# EAGLE design mainboard (EAGLE 6.3)
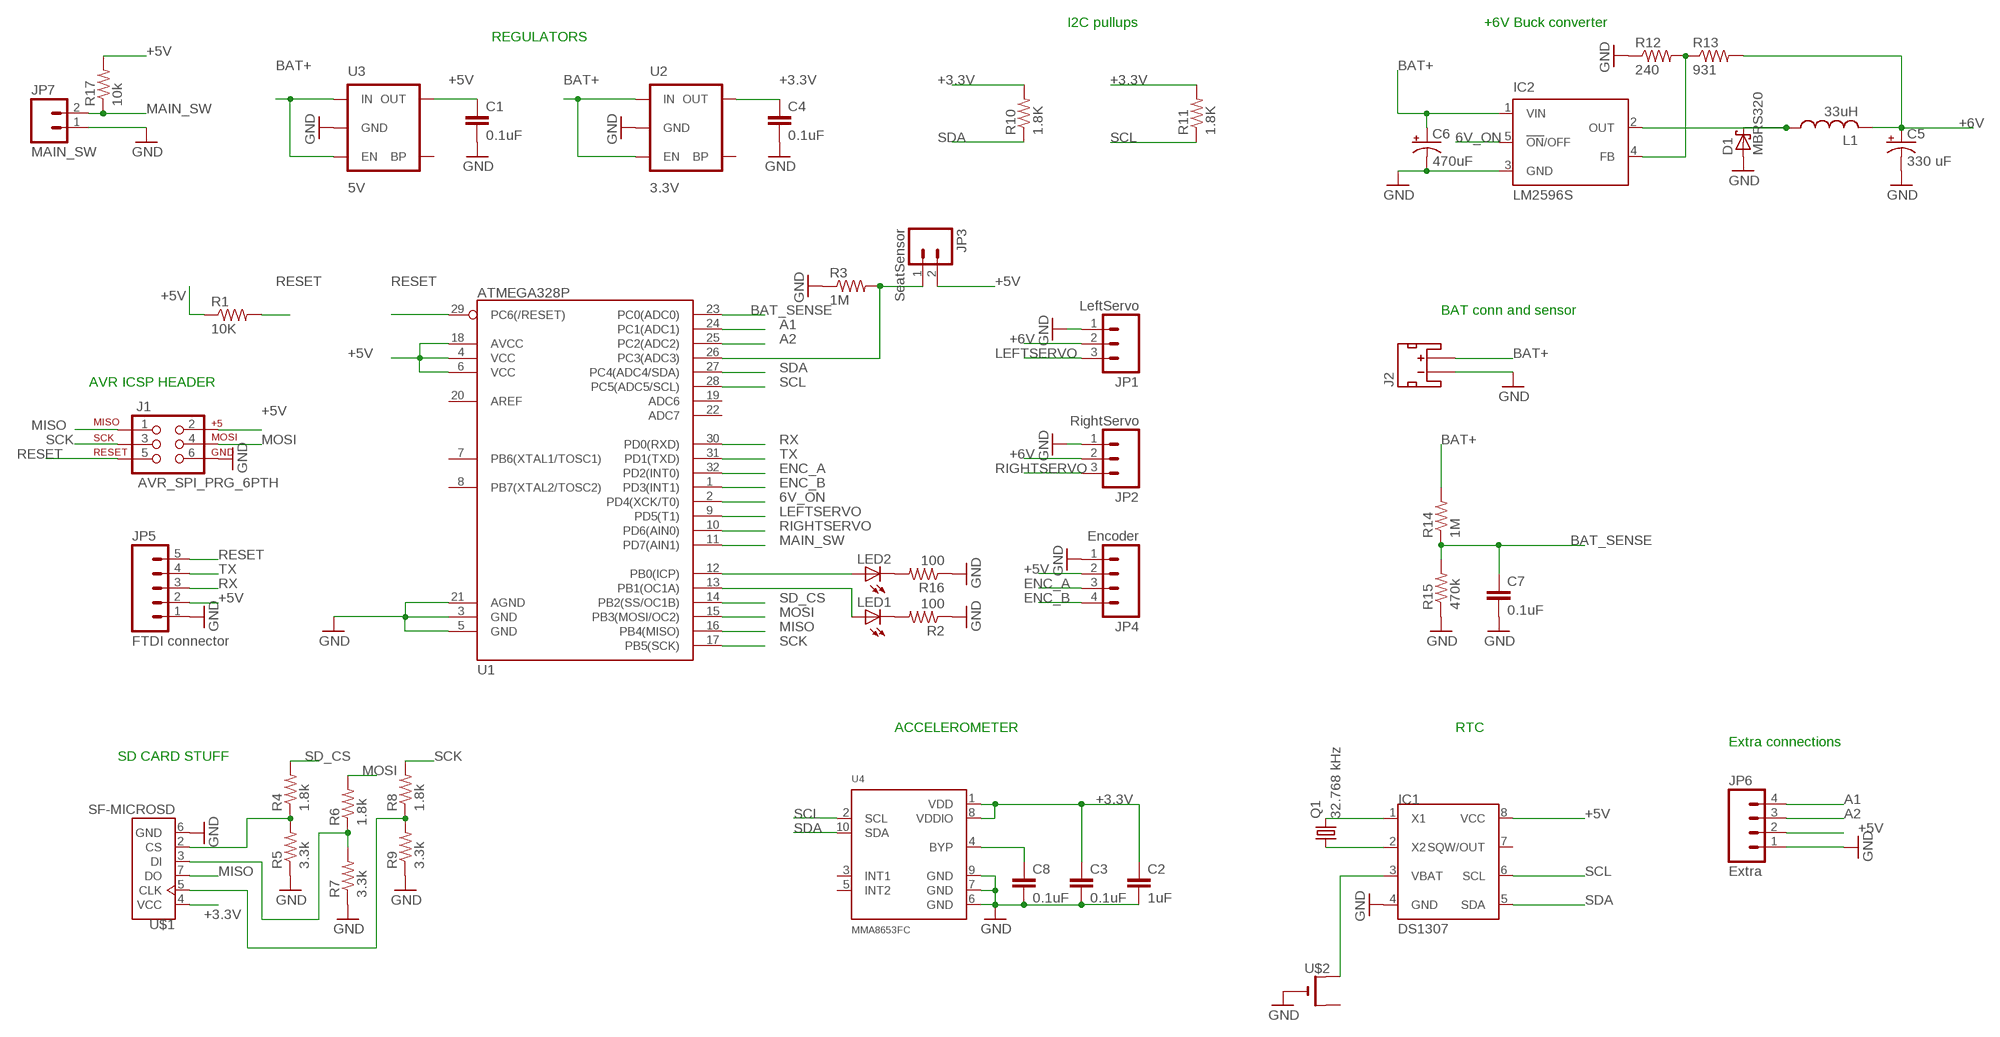
[diagram p0: schematic, sheet 1]

## Parts
C1  0.1uF  CAP0603-CAP  [0603-CAP]
C2  1uF  CAP0603-CAP  [0603-CAP]
C3  0.1uF  CAP0603-CAP  [0603-CAP]
C4  0.1uF  CAP0603-CAP  [0603-CAP]
C5  330 uF  CAP_POLE  [PANASONIC_E]
C6  470uF  CAP_POLG  [PANASONIC_G]
C7  0.1uF  CAP0603-CAP  [0603-CAP]
C8  0.1uF  CAP0603-CAP  [0603-CAP]
D1  MBRS320  SCHOTTKY-DIODESMC  [SMC]
IC1  DS1307  [SOIC-8]
IC2  LM2596S  [TO263-5]
J1  AVR_SPI_PRG_6PTH  [2X3]
J2  JST_2MM_MALE  [JST-2-SMD]
JP1  LeftServo  M03PTH  [1X03]
JP2  RightServo  M03PTH  [1X03]
JP3  SeatSensor  M02PTH  [1X02]
JP4  Encoder  M04PTH  [1X04]
JP5  FTDI connector  M05PTH  [1X05]
JP6  Extra  M04PTH  [1X04]
JP7  MAIN_SW  M02PTH  [1X02]
L1  33uH  L-SRR1280  [SRR1280]
LED1  LED1206  [LED-1206]
LED2  LED1206  [LED-1206]
Q1  32.768 kHz  CRYSTALTC38H  [TC38H]
R1  10K  RESISTOR0603-RES  [0603-RES]
R2  100  RESISTOR0603-RES  [0603-RES]
R3  1M  RESISTOR0603-RES  [0603-RES]
R4  1.8k  RESISTOR0603  [0603-RES]
R5  3.3k  RESISTOR0603  [0603-RES]
R6  1.8k  RESISTOR0603  [0603-RES]
R7  3.3k  RESISTOR0603  [0603-RES]
R8  1.8k  RESISTOR0603  [0603-RES]
R9  3.3k  RESISTOR0603  [0603-RES]
R10  1.8K  RESISTOR0603-RES  [0603-RES]
R11  1.8K  RESISTOR0603-RES  [0603-RES]
R12  240  RESISTOR0603  [0603-RES]
R13  931  RESISTOR0603  [0603-RES]
R14  1M  RESISTOR0603  [0603-RES]
R15  470k  RESISTOR0603  [0603-RES]
R16  100  RESISTOR0603  [0603-RES]
R17  10k  RESISTOR0603  [0603-RES]
U1  ATMEGA328P  ATMEGA328_SMT  [TQFP32-08]
U2  3.3V  MIC52053.3V  [SOT23-5]
U3  5V  MIC52055V  [SOT23-5]
U4  MMA8653FC  [DFN10-2X2]
U$1  SF-MICROSD  [MICROSD]
U$2  CR1220SMT  [CR1220-SMD]

## Nets
6V_ON: IC2.5(!ON!/OFF) U1.2(PD4(XCK/T0))
+3.3V: C2.1 C3.1 C4.1 R10.2 R11.2 U2.5(OUT) U4.1(VDD) U4.8(VDDIO) U$1.4(VCC)
+5V: C1.1 IC1.8(VCC) J1.2 JP3.2 JP4.2 JP5.2 JP6.2 R1.1 R17.2 U1.4(VCC) U1.6(VCC) U1.18(AVCC) U3.5(OUT)
+6V [ServoSupply]: C5.+ JP1.2 JP2.2 L1.2 R13.2
A1: JP6.4 U1.24(PC1(ADC1))
A2: JP6.3 U1.25(PC2(ADC2))
BAT+: C6.+ IC2.1(VIN) J2.2(+) R14.2 U2.1(IN) U2.3(EN) U3.1(IN) U3.3(EN)
BAT_SENSE: C7.1 R14.1 R15.2 U1.23(PC0(ADC0))
ENC_A: JP4.3 U1.32(PD2(INT0))
ENC_B: JP4.4 U1.1(PD3(INT1))
GND: C1.2 C2.2 C3.2 C4.2 C5.- C6.- C7.2 C8.2 D1.A IC1.4(GND) IC2.3(GND) J1.6 J2.1(-) JP1.1 JP2.1 JP4.1 JP5.1 JP6.1 JP7.1 R2.1 R3.1 R5.1 R7.1 R9.1 R12.1 R15.1 R16.1 U1.3(GND) U1.5(GND) U1.21(AGND) U2.2(GND) U3.2(GND) U4.6(GND) U4.7(GND) U4.9(GND) U$1.6(GND) U$2.-
LEFTSERVO: JP1.3 U1.9(PD5(T1))
MAIN_SW: JP7.2 R17.1 U1.11(PD7(AIN1))
MISO: J1.1 U1.16(PB4(MISO)) U$1.7(DO)
MOSI: J1.4 R6.2 U1.15(PB3(MOSI/OC2))
N$1: LED1.A U1.13(PB1(OC1A))
N$2: R8.1 R9.2 U$1.5(CLK)
N$3: R4.1 R5.2 U$1.2(CS)
N$4: LED1.C R2.2
N$5: JP3.1 R3.2 U1.26(PC3(ADC3))
N$6: R6.1 R7.2 U$1.3(DI)
N$7: IC1.3(VBAT) U$2.+$1(+)
N$8: IC1.1(X1) Q1.2
N$9: IC1.2(X2) Q1.1
N$10: D1.C IC2.2(OUT) L1.1
N$11: IC2.4(FB) R12.2 R13.1
N$12: LED2.C R16.2
N$13: LED2.A U1.12(PB0(ICP))
N$16: C8.1 U4.4(BYP)
RESET: J1.5 JP5.5 R1.2 U1.29(PC6(/RESET))
RIGHTSERVO: JP2.3 U1.10(PD6(AIN0))
RX: JP5.3 U1.30(PD0(RXD))
SCK: J1.3 R8.2 U1.17(PB5(SCK))
SCL: IC1.6(SCL) R11.1 U1.28(PC5(ADC5/SCL)) U4.2(SCL)
SD_CS: R4.2 U1.14(PB2(SS/OC1B))
SDA: IC1.5(SDA) R10.1 U1.27(PC4(ADC4/SDA)) U4.10(SDA)
TX: JP5.4 U1.31(PD1(TXD))
Unconnected: IC1.7(SQW/OUT) J2.NC1(PAD1) J2.NC2(PAD2) U1.7(PB6(XTAL1/TOSC1)) U1.8(PB7(XTAL2/TOSC2)) U1.19(ADC6) U1.20(AREF) U1.22(ADC7) U2.4(BP) U3.4(BP) U4.3(INT1) U4.5(INT2) U$2.+$2(+1)

## Notes on the sheet
- I2C pullups | +6V Buck converter
- REGULATORS
- BAT conn and sensor
- AVR ICSP HEADER
- ACCELEROMETER | RTC
- Extra connections
- SD CARD STUFF

## Library data of the parts
C1-C4 C7 C8 = SparkFun-Capacitors:CAP: Capacitor Standard 0603 ceramic capacitor, and 0.1" leaded capacitor.
C5 C6 = SparkFun-Capacitors:CAP_POL: Capacitor Polarized These are standard SMD and PTH capacitors. Normally 10uF, 47uF, and 100uF in electrolytic and tantalum varieties. Always verify the external diameter of the through hole cap, it varies with capacity, voltage, and manufacturer. The EIA devices should be standard.
D1 = diode:SCHOTTKY-DIODE: Schottky Diode
IC1 = dallas-1:DS1307: I2C Serial RTC w/56 bytes battery backed RAM
IC2 = national-semiconductor:LM2596: SIMPLE SWITCHER® Power Converter 150 kHz 3A Step-Down Voltage Regulator Source: http://www.national.com/ds/LM/LM2596.pdf; MF: NATIONAL SEMICONDUCTOR; MPN: LM2596S-ADJ/NOPB; OC_FARNELL: 9494367; OC_NEWARK: 41K3842
J1 = SparkFun-Connectors:AVR_SPI_PRG_6: AVR ISP 6 Pin This is the reduced ISP connector for AVR programming. Common on Arduino. This footprint will take up less PCB space and can be used with a 10-pin to 6-pin adapter such as SKU: BOB-08508
J2 = SparkFun-Connectors:JST_2MM_MALE: Mates to single-cell LiPo batteries. CONN-08352; PROD_ID: CONN-08352
JP1 JP2 = SparkFun-Connectors:M03: Header 3 Standard 3-pin 0.1" header. Use with straight break away headers (SKU : PRT-00116), right angle break away headers (PRT-00553), swiss pins (PRT-00743), machine pins (PRT-00117), and female headers (PRT-00115). Molex polarized connector foot print use with SKU : PRT-08232 with associated crimp pins and housings.
JP3 JP7 = SparkFun-Connectors:M02: Standard 2-pin 0.1" header. Use with - straight break away headers ( PRT-00116) - right angle break away headers (PRT-00553) - swiss pins (PRT-00743) - machine pins (PRT-00117) - female headers (PRT-00115) Molex polarized connector foot print use with: PRT-08233 with associated crimp pins and housings. 2.54_SCREWTERM for use with PRT-10571. 3.5mm Screw Terminal footprints for PRT-08084 5mm Screw Terminal footprints for use with PRT-08433
JP4 JP6 = SparkFun-Connectors:M04: Header 4 Standard 4-pin 0.1" header. Use with straight break away headers (SKU : PRT-00116), right angle break away headers (PRT-00553), swiss pins (PRT-00743), machine pins (PRT-00117), and female headers (PRT-00115). Molex polarized connector foot print use with SKU : PRT-08231 with associated crimp pins and housings. 1MM SMD Version SKU: PRT-10208
JP5 = SparkFun-Connectors:M05: Header 5 Standard 5-pin 0.1" header. Use with straight break away headers (SKU : PRT-00116), right angle break away headers (PRT-00553), swiss pins (PRT-00743), machine pins (PRT-00117), and female headers (PRT-00115). Molex polarized connector foot print use with SKU : PRT-08230 with associated crimp pins and housings.
L1 = srr1280:L
LED1 LED2 = SparkFun-LED:LED: LEDs Standard schematic elements and footprints for 5mm, 3mm, 1206, and 0603 sized LEDs. 5mm - Spark Fun Electronics SKU : COM-00529 (and others)
Q1 = adafruit:CRYSTAL: CRYSTAL; OC_FARNELL: unknown; OC_NEWARK: unknown
R1-R17 = SparkFun-Resistors:RESISTOR: Resistor Basic schematic elements and footprints for 0603, 1206, and PTH resistors.
U1 = SparkFun-DigitalIC:ATMEGA328_SMT: 32-Pin Atmega328 part Commonly used on Arduino compatible boards Available in QFP and QFN packages TQFP is IC-09069 QFN is non-stock; PROD_ID: IC-09069
U2 = SparkFun-PowerIC:MIC5205: MIC5205 150mA vreg 3.3V - VREG-00822 5V - VREG-00823; PROD_ID: VREG-00822
U3 = SparkFun-PowerIC:MIC5205: MIC5205 150mA vreg 3.3V - VREG-00822 5V - VREG-00823; PROD_ID: VREG-00823
U4 = logic-supply:MMA8653
U$1 = microsd:SF-MICROSD
U$2 = adafruit:CR1220: CR1216/CR1220/CR1225 12mm 3V lithium coin cell Great for battery packup. Both SMT and THM holders. Note the THM package has the ground pads on both sides of the PCB so that the masks are the same - this reduces the cost

## Net classes
1 ServoSupply: width 0.813 mm
2 BatBig: width 0.813 mm

## Board
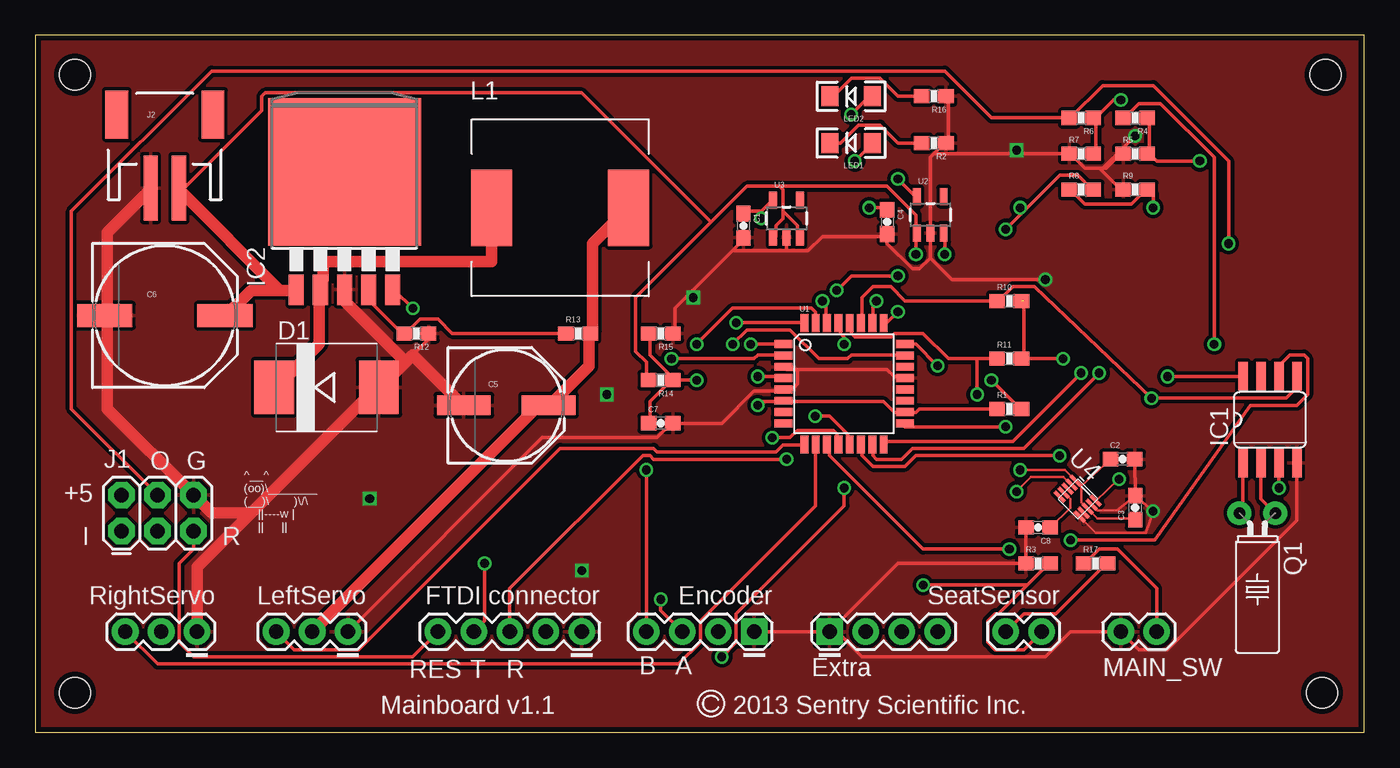
[diagram p1: board, top side]
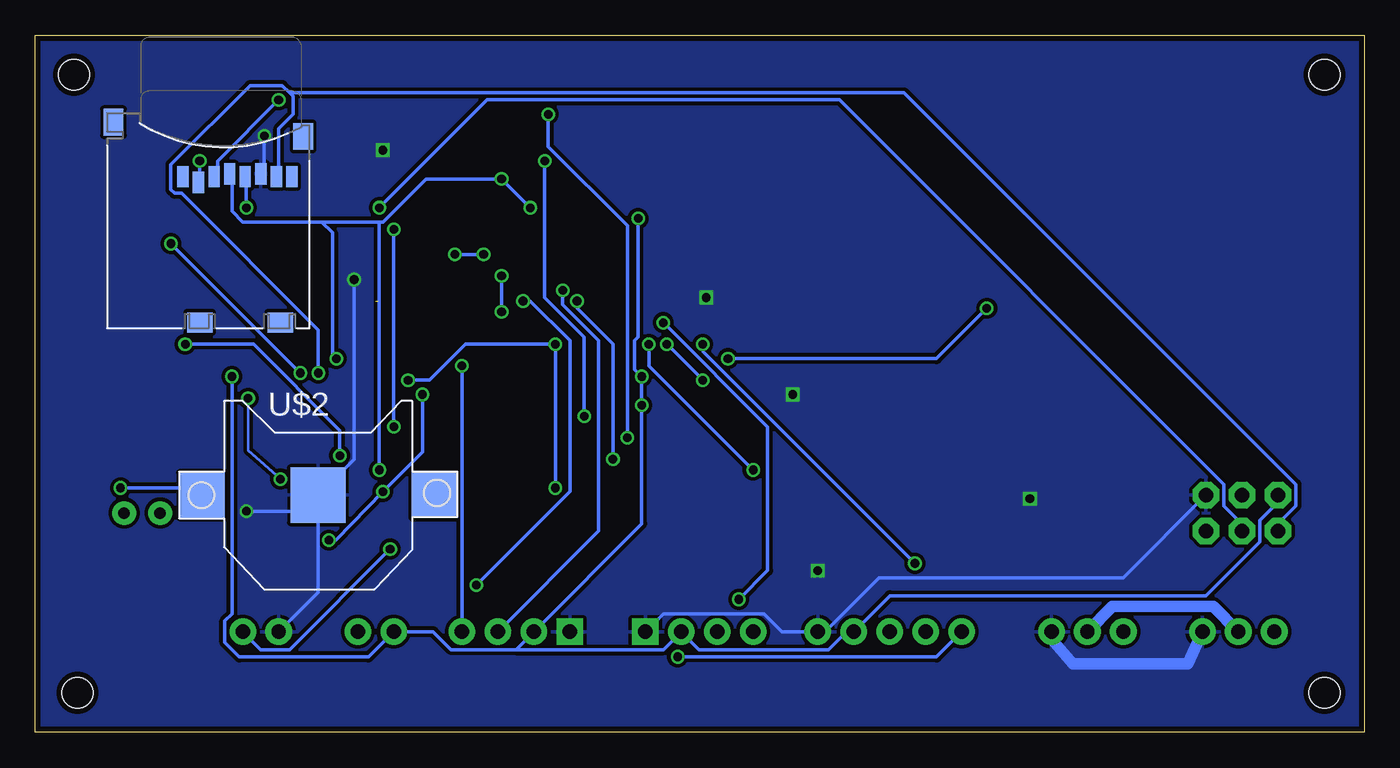
[diagram p2: board, bottom side, seen from below]

Size 93.9 x 49.27 mm. Coordinates in mm from the lower left corner, seen from the top.
Outline: 0,0 93.9,0 93.9,49.27 0,49.27 0,0
Copper layers (1*16): Top 0.0356mm / dielectric 1.5011mm / Bottom 0.0356mm
Design rules "LaenPCBOrder": minimum track width 6mil, minimum drill 13mil, track to track 6mil, track to pad 6mil, pad to pad 6mil, via to via 6mil, smd to smd 6mil, copper to edge 15mil, drill to drill 6mil, minimum pad ring 7mil, minimum via ring 7mil, stop-mask expansion 3mil, vias tented up to drill 0mil, thermal gap 10mil
Holes 2.18 mm at 2.79,46.48 91.19,46.48 90.93,2.79 2.79,2.79

### Footprints (pad centres in the part's own frame; a part is rotated, then mirrored left to right if it is on the bottom)
0603-CAP = smd 1.1 x 1: 1 -0.85,0; 2 0.85,0
PANASONIC_E = smd 3.8 x 1.4: + 3,0; - -3,0
PANASONIC_G = smd 3.9 x 1.6: + 4.25,0; - -4.25,0
SMC = smd 2.8 x 3.8: A 3.7,0; C -3.7,0
SOIC-8 = smd 2.032 x 0.66: 1 -3.073,1.27; 2 -3.073,0; 3 -3.073,-1.27; 4 -3.073,-2.54; 5 3.073,-2.54; 6 3.073,-1.27; 7 3.073,0; 8 3.073,1.27
TO263-5 = smd 1.067 x 2.159: 1 -3.404,-5.791; 2 -1.702,-5.791; 3 0,-5.791; 4 1.702,-5.791; 5 3.404,-5.791 | smd 10.8 x 10.41: 6 0,2.54
2X3 = drill 1.016 pad 1.88 octagon: 1 0,0; 2 0,2.54; 3 2.54,0; 4 2.54,2.54; 5 5.08,0; 6 5.08,2.54
JST-2-SMD = smd 1 x 4.6: 1 -1,-3.7; 2 1,-3.7 | smd 1.6 x 3.4: NC1 -3.4,1.5; NC2 3.4,1.5
1X03 = drill 1.016 pad 1.88: 1 0,0; 2 2.54,0; 3 5.08,0
1X02 = drill 1.016 pad 1.88: 1 0,0; 2 2.54,0
1X04 = drill 1.016 pad 1.88 square: 1 0,0 | drill 1.016 pad 1.88: 2 2.54,0; 3 5.08,0; 4 7.62,0
1X05 = drill 1.016 pad 1.88: 1 0,0; 2 2.54,0; 3 5.08,0; 4 7.62,0; 5 10.16,0
SRR1280 = smd 2.896 x 5.41: 1 -4.851,0; 2 4.851,0
LED-1206 = smd 1.2 x 1.4: A -1.5,0; C 1.5,0
TC38H = drill 0.813 pad 1.676: 1 -1.27,0; 2 1.27,0
0603-RES = smd 1.1 x 1: 1 -0.85,0; 2 0.85,0
TQFP32-08 = smd 1.27 x 0.559: 1 -4.293,2.8; 2 -4.293,2; 3 -4.293,1.2; 4 -4.293,0.4; 5 -4.293,-0.4; 6 -4.293,-1.2; 7 -4.293,-2; 8 -4.293,-2.8; 17 4.293,-2.8; 18 4.293,-2; 19 4.293,-1.2; 20 4.293,-0.4; 21 4.293,0.4; 22 4.293,1.2; 23 4.293,2; 24 4.293,2.8 | smd 0.559 x 1.27: 9 -2.8,-4.293; 10 -2,-4.293; 11 -1.2,-4.293; 12 -0.4,-4.293; 13 0.4,-4.293; 14 1.2,-4.293; 15 2,-4.293; 16 2.8,-4.293; 25 2.8,4.293; 26 2,4.293; 27 1.2,4.293; 28 0.4,4.293; 29 -0.4,4.293; 30 -1.2,4.293; 31 -2,4.293; 32 -2.8,4.293
SOT23-5 = smd 0.55 x 1.2: 1 -0.95,-1.3; 2 0,-1.3; 3 0.95,-1.3; 4 0.95,1.3; 5 -0.95,1.3
DFN10-2X2 = smd 1 x 0.225: 1 -1,0.8; 2 -1,0.4; 3 -1,0; 4 -1,-0.4; 5 -1,-0.8; 6 1,-0.8; 7 1,-0.4; 8 1,0; 9 1,0.4; 10 1,0.8
MICROSD = smd 0.8 x 1.5: 1 -1.94,2.7; 2 -0.84,2.3; 3 0.26,2.7; 4 1.36,2.9; 5 2.46,2.7; 6 3.56,2.9; 7 4.66,2.7; 8 5.76,2.7 | smd 1.4 x 1.9: NC -6.85,6.55; NC3 6.55,5.55 | smd 1.8 x 1.4: NC1 -0.75,-7.6; NC2 4.95,-7.6
CR1220-SMD = smd 3.2 x 3.2: +$1 -8.2,0; +$2 8.2,0 | smd 3.9 x 3.9: - 0,0

### Placement (x,y rotation side)
C1  50.04,35.81 270 top
C2  76.83,19.3 0 top
C3  77.72,15.88 90 top
C4  60.2,36.07 270 top
C5  33.27,23.11 0 top
C6  9.14,29.46 0 top
C7  44.2,21.84 0 top
C8  70.87,14.48 180 top
D1  20.57,24.38 0 top
IC1  86.61,22.1 90 top
IC2  21.84,37.08 0 top
J1  6.1,14.22 0 top
J2  9.14,42.16 0 top
JP1  22.1,7.11 180 top
JP2  11.43,7.11 180 top
JP3  71.12,7.11 180 top
JP4  50.8,7.11 180 top
JP5  38.61,7.11 180 top
JP6  56.13,7.11 0 top
JP7  76.71,7.11 0 top
L1  37.08,37.08 0 top
LED1  57.66,41.66 180 top
LED2  57.66,44.96 180 top
Q1  86.36,15.49 180 top
R1  68.83,22.86 0 top
R2  63.5,41.66 180 top
R3  70.87,11.94 0 top
R4  77.72,43.43 180 top
R5  77.72,40.89 0 top
R6  73.91,43.43 180 top
R7  73.91,40.89 0 top
R8  73.91,38.35 0 top
R9  77.72,38.35 0 top
R10  68.83,30.48 0 top
R11  68.83,26.42 0 top
R12  26.92,28.19 180 top
R13  38.35,28.19 0 top
R14  44.2,24.89 180 top
R15  44.2,28.19 180 top
R16  63.5,44.96 180 top
R17  74.93,11.94 0 top
U1  57.15,24.64 0 top
U2  63.25,36.58 0 top
U3  53.09,36.32 0 top
U4  73.66,16.51 315 top
U$1  81.53,36.58 0 bottom
U$2  73.91,16.76 0 bottom

### Tracks (layer width: path | path; a pad name or v marks a point on that pad's centre or on a via)
6V_ON  (via drill 0.61)
  Top 0.254: v44.96,26.42 50.8,26.42 51.05,26.67 52.83,26.67 U1.2 | v26.67,29.97 25.4,31.24 IC2.5
  Bottom 0.254: v44.96,26.42 30.23,26.42 v26.67,29.97
+3.3V  (via drill 0.6, 0.61)  (1 unrouted)
  Top 0.178: v69.6,18.54 72.77,18.54 U4.1 73.79,17.53 73.91,17.4 | 73.91,17.4 73.91,16.26 U4.8 | U4.8 | U4.8 75.06,15.11 77.72,15.11 C3.1 | 73.91,17.4 C2.1
  Top 0.254: v58.93,37.08 60.2,37.08 C4.1 | v60.96,39.12 62.23,37.85 U2.5 | 69.85,30.48 69.85,26.42 | 69.85,26.42 R11.2 | v72.64,26.42 69.85,26.42
  Bottom 0.254: v58.93,37.08 v60.96,39.12 66.29,39.12 69.34,36.07 69.6,36.07 | 69.6,36.07 73.66,36.07 | 73.66,36.07 79.25,36.07 80.01,36.83 80.01,39.37 U$1.4 | 69.6,36.07 v69.6,18.54 | 73.66,36.07 72.9,35.31 72.9,26.67 v72.64,26.42
+5V  (via drill 0.61)
  Top 0.254: JP3.2 69.85,8.38 72.14,8.38 75.69,11.94 R17.2 | v80.01,25.15 85.34,25.15 IC1.8 | R1.1 62.48,22.86 62.23,22.61 61.47,22.61 U1.18 61.21,22.61 60.71,22.61 59.94,23.37 53.09,23.37 U1.6 52.83,23.37 51.31,23.37 v51.05,23.11 | 51.31,36.83 50.04,36.83 C1.1 | 51.31,36.83 52.07,37.59 U3.5 | v51.05,25.15 52.83,25.15 U1.4 | v51.31,36.32 51.31,36.83
  Bottom 0.254: J1.2 6.1,16.26 7.37,14.99 7.37,13.46 11.18,9.65 33.53,9.65 JP5.2 36.58,7.11 37.85,5.84 46.99,5.84 JP4.2 49.53,5.84 59.94,5.84 | v80.01,25.15 80.01,8.38 80.52,7.87 80.52,6.35 79.5,5.33 70.36,5.33 JP3.2 65.79,7.11 64.52,5.84 59.94,5.84 | v51.31,36.32 51.31,27.94 51.56,27.69 51.56,25.65 v51.05,25.15 v51.05,23.11 51.05,14.73 JP6.2 59.94,5.84
+6V
  Top 0.813: L1.2 41.91,37.08 39.37,34.54 39.37,28.45 R13.2 39.12,28.19 39.12,25.91 36.32,23.11 C5.+ 36.07,22.86 35.31,22.86 JP1.2
  Bottom 0.813: JP2.2 10.67,8.89 17.78,8.89 JP1.2
A1  (via drill 0.61)
  Top 0.254: v63.75,25.91 62.23,27.43 61.47,27.43 U1.24
  Bottom 0.254: JP6.4 v63.75,25.91
A2  (via drill 0.61)
  Top 0.254: v60.96,29.72 60.2,28.96 U1.25 | v60.96,32.26 57.66,32.26 v56.64,31.24
  Bottom 0.254: v60.96,32.26 v60.96,29.72 | v56.64,31.24 56.64,30.23 54.1,27.69 54.1,14.22 JP6.3
BAT+  (via drill 0.61)
  Top 0.254: 18.29,31.24 IC2.1 | 13.46,29.46 C6.+ | 10.16,38.35 J2.2 10.16,38.61 10.67,38.61 16,43.94 16,44.96 16.26,45.21 38.61,45.21 47.75,36.07 | 47.75,36.07 50.29,38.61 52.58,38.61 | 47.75,36.07 42.42,30.73 42.42,26.92 43.18,26.16 43.18,24.89 R14.2 | 52.58,38.61 52.83,38.35 52.83,36.83 | 52.83,36.83 52.83,36.32 52.32,35.81 52.32,35.05 U3.1 | 52.83,36.83 53.85,35.81 53.85,35.05 U3.3 | 52.58,38.61 60.2,38.61 62.23,36.58 62.23,35.31 U2.1 62.23,35.05 v62.23,33.78 | v64.26,33.78 64.26,35.05 U2.3
  Top 0.813: 17.27,31.24 15.24,31.24 13.46,29.46 | 17.27,31.24 18.29,31.24 | 17.27,31.24 10.16,38.35
  Bottom 0.254: v62.23,33.78 v64.26,33.78
BAT_SENSE  (via drill 0.61)
  Top 0.254: C7.1 43.43,21.84 43.43,23.37 44.96,24.89 R14.1 45.21,24.89 | 45.21,24.89 43.43,26.67 43.43,28.19 R15.2 | v49.28,27.43 50.29,28.45 53.34,28.45 55.37,26.42 57.4,26.42 57.66,26.67 61.21,26.67 U1.23 | 45.21,24.89 v46.74,24.89
  Bottom 0.254: v46.74,24.89 v49.28,27.43
ENC_A  (via drill 0.61)
  Top 0.254: v49.53,28.96 54.1,28.96 U1.32 | v44.2,9.4 44.2,8.64 JP4.3
  Bottom 0.254: v49.53,28.96 42.16,21.59 42.16,11.43 v44.2,9.4
ENC_B  (via drill 0.61)
  Top 0.254: v50.55,27.43 52.83,27.43 U1.1 | JP4.4 v43.18,18.54
  Bottom 0.254: v50.55,27.43 50.55,25.91 v43.18,18.54
GND  (via drill 0.6, 0.61)
  Top 0.178: U4.9 75.06,15.68 76.42,15.68 C3.2 v78.99,15.62 78.49,14.1 74.93,14.1 U4.6 U4.7
  Top 0.254: 49.28,34.04 50.04,34.8 C1.2 | 49.28,34.04 45.21,29.97 45.21,28.19 R15.1 | 60.2,35.05 55.63,35.05 54.61,34.04 53.09,34.04 | 49.28,34.04 53.09,34.04 | 53.09,34.04 U3.2 | 75.44,39.88 75.69,39.88 76.71,40.89 R5.1 | 75.44,39.88 75.18,39.88 | 75.18,39.88 74.17,39.88 73.15,40.89 R7.1 63.5,40.89 | 75.18,39.88 76.71,38.35 R9.1 | 75.44,39.88 v77.72,42.16 | R16.1 64.52,44.96 64.52,41.66 R2.1 64.26,41.66 63.5,40.89 | 63.5,40.89 63.25,40.64 U2.2 63.25,33.53 | 60.2,35.05 60.2,34.54 61.98,32.77 62.48,32.77 63.25,33.53 | 60.2,35.05 C4.2 | IC1.4 89.15,14.99 80.01,5.84 77.98,5.84 JP7.1 73.15,7.11 71.37,5.33 58.42,5.33 56.39,7.37 | 70.1,11.94 R3.1 | JP4.1 JP6.1 56.39,7.37 | R3.1 60.96,11.94 56.39,7.37 | 63.25,33.53 64.77,32 v71.37,32 | 21.84,31.5 IC2.3 21.84,30.48 | 26.67,26.67 27.69,27.69 27.69,28.19 R12.1 | 24.38,24.38 D1.A 24.13,24.38 | 30.23,23.11 C5.- | 8.13,38.35 J2.1 | 53.85,25.65 60.2,25.65 60.71,25.15 61.21,25.15 U1.21 | 53.85,25.65 53.09,25.65 U1.3 | 53.85,25.65 53.85,24.64 53.59,24.38 53.09,24.38 U1.5 52.83,24.13 50.8,24.13 48.51,21.84 C7.2 44.96,21.84 43.94,20.83 35.81,20.83 JP1.1 | 5.08,29.46 C6.- | C8.2 R3.1 | C3.2 C2.2
  Top 0.813: 24.38,24.38 26.16,26.16 | 26.16,26.16 26.67,26.67 30.23,23.11 | 26.16,26.16 21.84,30.48 | 8.13,38.35 5.08,35.31 5.08,29.46 5.08,22.86 J1.6 12.45,15.49 15.24,15.49 | JP2.1 11.43,11.68 15.24,15.49 | 15.24,15.49 24.13,24.38
  Bottom 0.254: v77.72,42.16 77.72,39.62 U$1.6 | U$2.- 73.91,9.91 JP7.1 | JP4.1 49.53,8.38 42.42,8.38 41.15,7.11 JP5.1 38.1,7.11 34.29,10.92 17.02,10.92 J1.6 | v71.37,32 71.37,19.3 U$2.- | v78.99,15.62 75.06,15.62 75.06,16.76 U$2.-
  Bottom 0.813: JP1.1 22.1,6.6 20.57,4.83 12.45,4.83 JP2.1
  other vias: 23.62,16.51 69.34,41.15 38.61,11.43 40.39,23.88 46.48,30.73
  pour Bottom (isolate 0.254): -1.52,50.04 95.25,50.04 95.25,-1.4 -1.78,-1.4 -1.78,50.04
  pour Top (isolate 0.254): -1.02,50.16 95.38,50.16 95.38,-1.14 -1.14,-1.14 -1.14,50.16
LEFTSERVO
  Top 0.254: JP1.3 18.29,5.84 22.86,5.84 37.08,20.07 43.69,20.07 43.94,19.81 52.32,19.81 52.83,20.32 54.1,20.32 U1.9
MAIN_SW  (via drill 0.61)
  Top 0.254: JP7.2 79.25,10.16 76.45,12.95 75.18,12.95 74.17,11.94 R17.1 | v68.83,12.95 62.74,12.95 56.13,19.56 56.13,20.32 U1.11
  Bottom 0.254: v68.83,12.95 75.95,5.84 77.98,5.84 JP7.2
MISO  (via drill 0.61)
  Top 0.254: v73.91,25.4 69.09,20.57 60.2,20.57 U1.16
  Bottom 0.254: v73.91,25.4 73.91,28.45 83.57,38.1 84.07,38.1 84.33,38.35 84.33,40.13 78.74,45.72 76.45,45.72 75.95,45.21 | 75.95,45.21 75.69,44.96 75.69,43.69 76.71,42.67 76.71,39.37 U$1.7 | J1.1 6.1,14.73 4.83,16 4.83,17.53 32.51,45.21 75.95,45.21
MOSI  (via drill 0.61)
  Top 0.254: J1.4 2.54,22.86 2.54,36.83 12.45,46.74 64.26,46.74 67.56,43.43 R6.2 73.15,43.43 75.44,45.72 78.99,45.72 84.33,40.39 v84.33,34.54 | v75.18,25.4 69.85,20.07 61.98,20.07 61.21,19.3 59.44,19.3 59.18,19.56 59.18,20.32 U1.15
  Bottom 0.254: v84.33,34.54 v75.18,25.4
N$1  (via drill 0.61)
  Top 0.254: v55.12,22.35 56.13,22.35 57.4,21.08 57.4,20.57 U1.13 | v57.91,40.39 59.18,41.66 LED1.A
  Bottom 0.254: v55.12,22.35 55.12,27.94 57.91,30.73 v57.91,40.39
N$2  (via drill 0.61)
  Top 0.254: R8.1 73.15,38.35 74.17,37.34 77.47,37.34 78.49,38.35 R9.2 78.74,38.35 78.99,38.1 v78.99,37.08
  Bottom 0.254: v78.99,37.08 78.99,39.12 U$1.5
N$3  (via drill 0.61)
  Top 0.254: 78.74,40.89 78.74,43.43 R4.1 | v82.3,40.39 79.25,40.39 78.74,40.89 | 78.74,40.89 R5.2
  Bottom 0.254: v82.3,40.39 82.3,39.12 U$1.2
N$4
  Top 0.254: R2.2 60.96,41.66 59.69,42.93 58.17,42.93 56.9,41.66 LED1.C
N$5  (via drill 0.61)
  Top 0.254: 70.1,10.41 68.07,8.38 67.82,8.38 67.31,7.87 67.31,6.35 67.82,5.84 69.85,5.84 JP3.1 | 70.1,10.41 71.63,11.94 R3.2 | v59.44,30.48 59.18,30.23 59.18,28.96 U1.26 | 70.1,10.41 v62.74,10.41
  Bottom 0.254: v59.44,30.48 58.93,30.48 56.13,27.69 56.13,17.02 v62.74,10.41
N$6  (via drill 0.61)
  Top 0.254: 74.93,43.43 74.93,40.89 R7.2 | v76.71,44.7 76.2,44.7 74.93,43.43 | 74.93,43.43 R6.1
  Bottom 0.254: v76.71,44.7 81.03,40.39 81.03,39.37 U$1.3
N$7  (via drill 0.61)
  Top 0.254: v87.88,17.27 IC1.3
  Bottom 0.254: v87.88,17.27 82.8,17.27 82.3,16.76 U$2.+$1
N$8
  Top 0.254: IC1.1 85.34,15.75 Q1.2
N$9
  Top 0.254: IC1.2 86.61,16.51 Q1.1
N$10
  Top 0.254: 20.07,31.24 IC2.2 20.32,31.5 20.32,32 | 17.02,24.38 D1.C
  Top 0.813: 20.07,31.24 20.07,27.43 17.02,24.38 | 20.32,32 20.32,33.27 32.23,33.27 L1.1
N$11
  Top 0.254: IC2.4 23.62,31.24 23.62,30.48 25.91,28.19 R12.2 26.16,28.19 27.18,29.21 28.45,29.21 29.46,28.19 R13.1
N$12
  Top 0.254: R16.2 60.96,44.96 59.69,46.23 57.66,46.23 56.39,44.96 LED2.C
N$13  (via drill 0.61)
  Top 0.254: v52.07,20.83 53.34,20.83 53.85,21.34 56.39,21.34 56.64,21.08 56.64,20.57 U1.12 | v57.66,43.69 58.93,44.96 LED2.A
  Bottom 0.254: v52.07,20.83 52.07,35.81 57.66,41.4 v57.66,43.69
N$16
  Top 0.178: U4.4 73.15,16.51 73.15,15.88 C8.1
RESET  (via drill 0.61)
  Top 0.254: v67.56,24.89 69.6,22.86 R1.2 | v57.15,27.43 57.15,27.94 56.9,28.19 56.9,28.7 U1.29 | J1.5 11.18,12.95 10.16,11.94 10.16,6.35 11.18,5.33 26.67,5.33 JP5.5 | v57.15,17.27 57.15,16 49.53,8.38 49.53,6.35 v48.51,5.33
  Bottom 0.254: v67.56,24.89 66.04,24.89 63.5,27.43 v57.15,27.43 v57.15,17.27 | v48.51,5.33 30.23,5.33 JP5.5
RIGHTSERVO
  Top 0.254: JP2.3 8.64,4.83 45.47,4.83 46.99,6.35 46.99,7.87 55.12,16 55.12,20.32 U1.10
RX  (via drill 0.61)
  Top 0.254: v55.63,30.48 55.88,30.23 55.88,28.96 U1.30 | v53.09,19.3 43.69,19.3 43.43,19.56 42.93,19.56 33.53,10.16 JP5.3
  Bottom 0.254: v55.63,30.48 55.63,29.97 53.09,27.43 v53.09,19.3
SCK  (via drill 0.61)
  Top 0.254: v68.58,35.56 69.85,36.83 | 69.85,36.83 72.39,39.37 73.66,39.37 74.68,38.35 R8.2 | v68.58,21.59 61.47,21.59 U1.17 | 69.85,36.83 v69.6,37.08
  Bottom 0.254: v68.58,21.59 v68.58,35.56 | J1.3 8.64,14.73 9.91,16 9.91,17.53 37.08,44.7 61.98,44.7 v69.6,37.08
SCL  (via drill 0.6, 0.61)
  Top 0.178: U4.2 72.64,18.03 70.36,18.03 v69.34,17.02
  Top 0.254: 66.55,26.42 64.52,26.42 62.74,28.19 60.71,28.19 60.45,27.94 57.91,27.94 57.66,28.19 57.66,28.7 U1.28 | 66.55,26.42 R11.1 | IC1.6 87.88,25.91 88.65,26.67 89.66,26.67 89.92,26.42 89.92,23.88 89.15,23.11 85.85,23.11 79.12,13.59 v73.15,13.59 | v66.55,23.88 66.55,26.42
  Bottom 0.254: v66.55,23.88 66.55,19.81 v69.34,17.02 72.64,13.59 v73.15,13.59
SD_CS  (via drill 0.61)
  Top 0.254: v83.31,27.43 83.31,40.64 79.5,44.45 77.98,44.45 76.96,43.43 R4.2 | v72.39,19.56 62.23,19.56 61.47,18.8 59.18,18.8 58.42,19.56 58.42,20.32 U1.14
  Bottom 0.254: v72.39,19.56 72.39,21.34 78.49,27.43 v83.31,27.43
SDA  (via drill 0.6)
  Top 0.178: U4.10 v76.58,17.91
  Top 0.254: U1.27 58.42,28.96 58.42,30.73 59.18,31.5 60.45,31.5 61.47,30.48 R10.1 68.07,30.48 69.09,31.5 70.61,31.5 v78.87,23.62 88.39,23.62 89.15,24.38 IC1.5
  Bottom 0.178: v78.87,23.62 78.87,19.94 v76.58,17.91
TX  (via drill 0.61)
  Top 0.254: v46.74,27.43 49.28,29.97 54.86,29.97 55.12,29.72 55.12,28.96 U1.31 | v31.75,11.94 31.75,7.87 JP5.4
  Bottom 0.254: v46.74,27.43 46.74,26.92 v31.75,11.94

### Text on the board
_tsilk: O | G | +5 | ^__^ / (oo)\_______ / (__)\ )\/\ / ||----w | / || || | I | R | RES | T | R | B | A | Mainboard v1.1 | 2013 Sentry Scientific Inc.